# Altium schematic sheet Sheet2.SchDoc
size A3
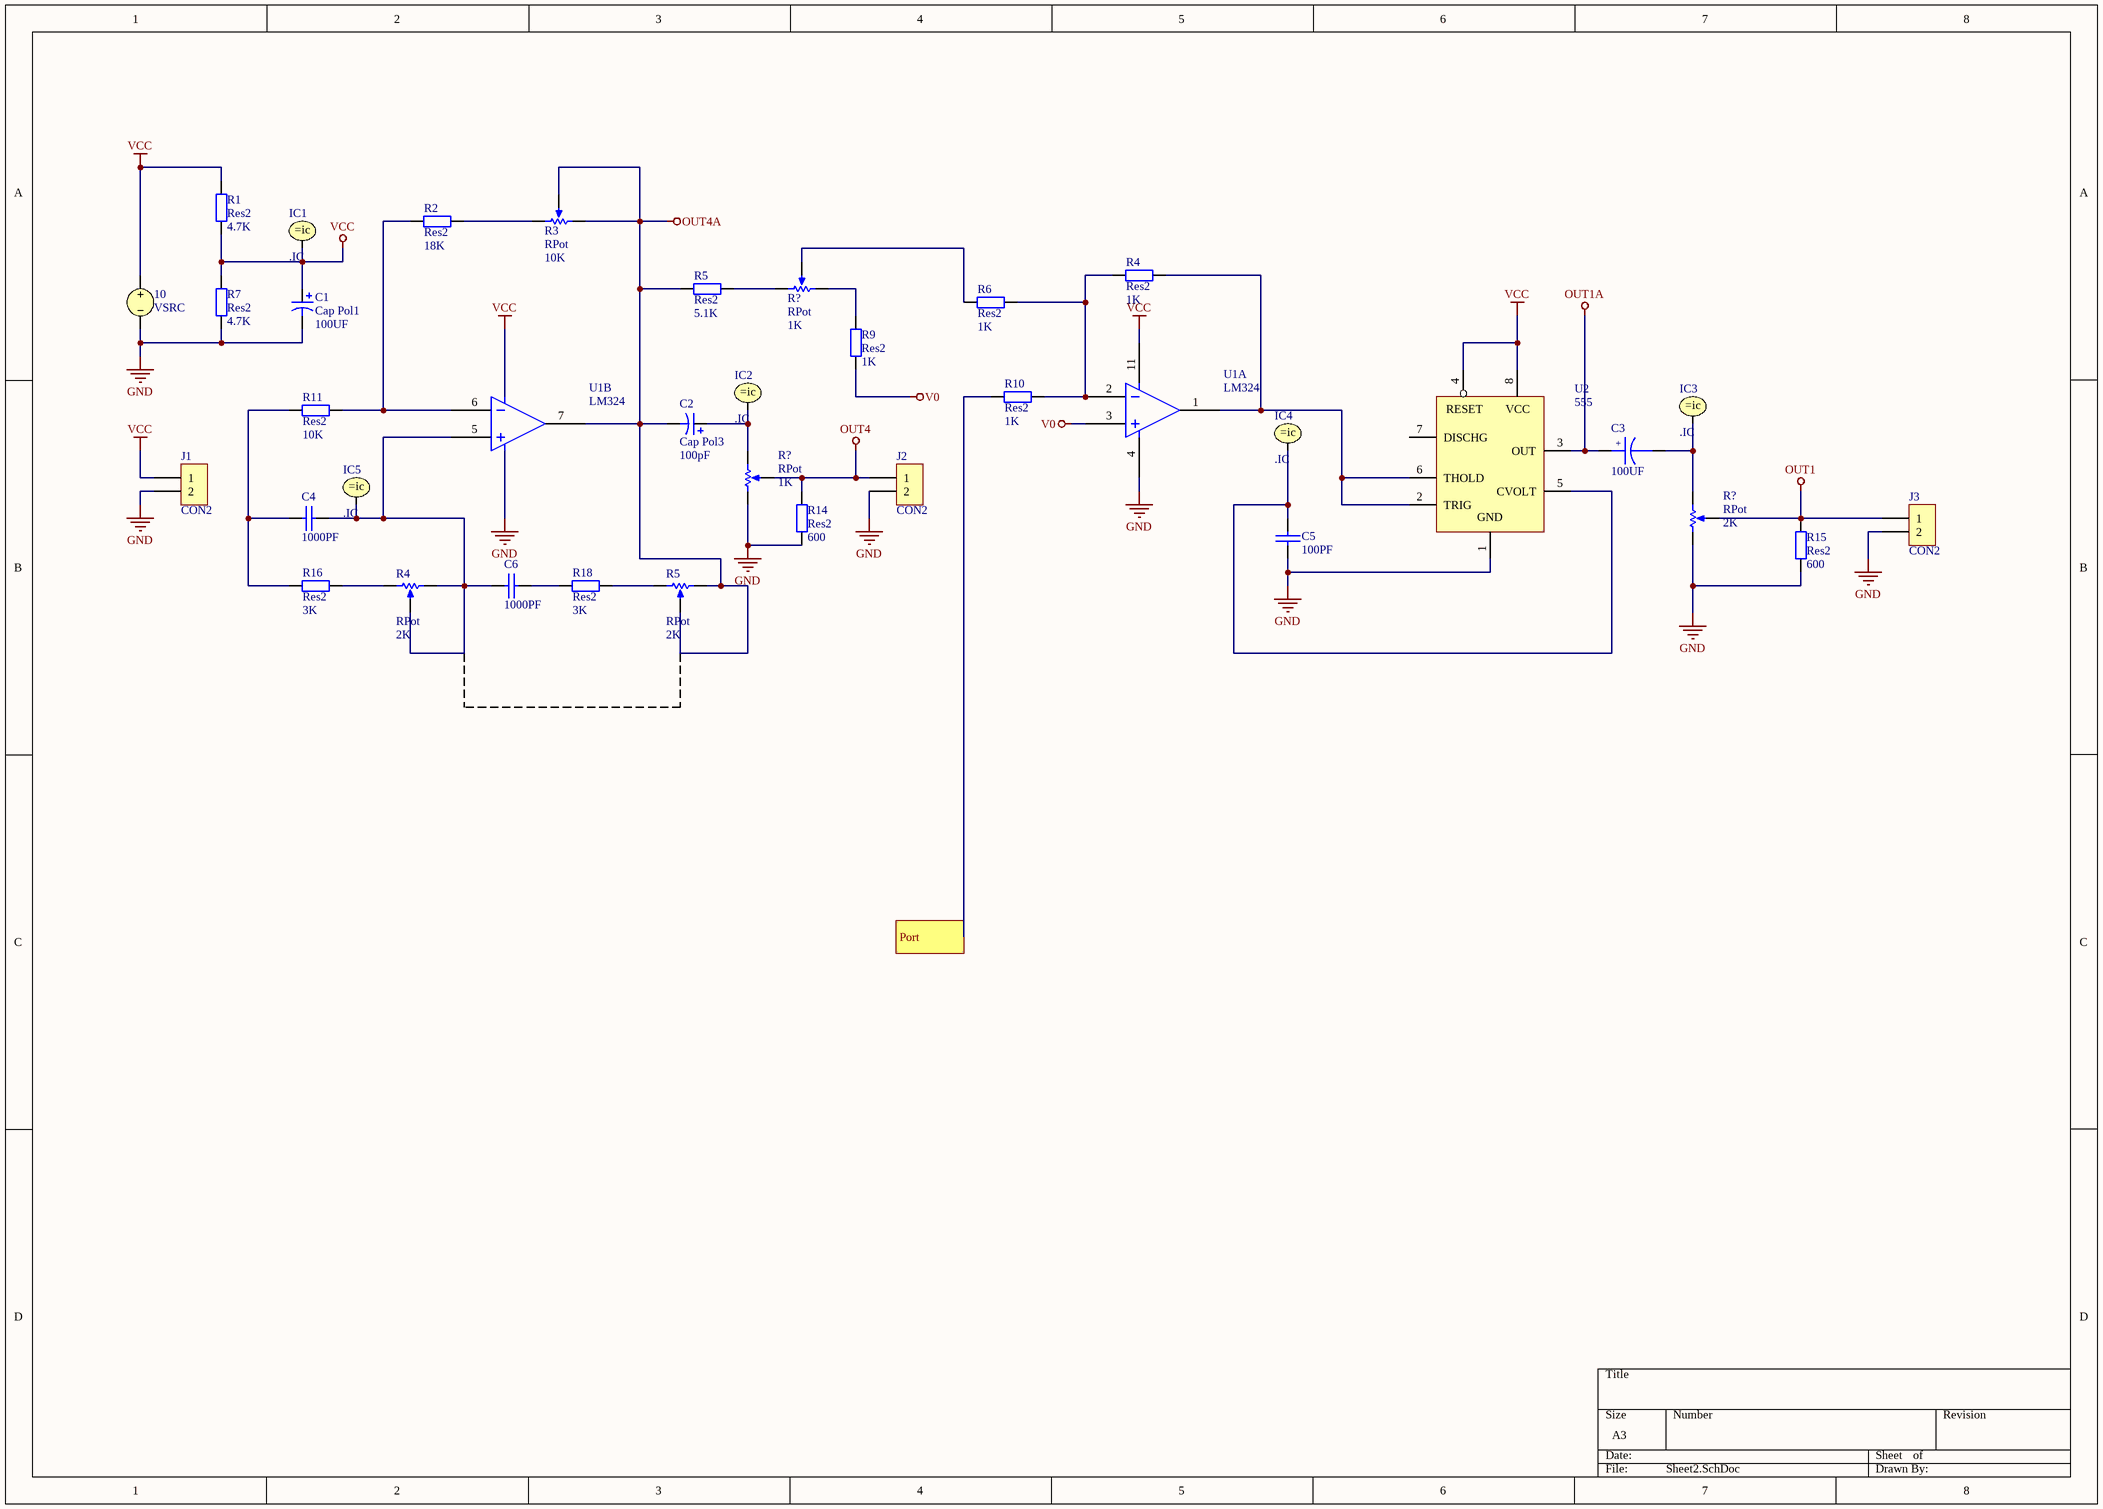
[diagram p0: Sheet2.SchDoc]

## Parts
(Parts that share a designator on the sheet are numbered #1, #2 ... from top to bottom, then left to right.)
10  VSRC
C1  Cap Pol1  value 100UF  [RB7.6-15]
C2  Cap Pol3  value 100pF  [C0805]
C3  100UF
C4  1000PF  [RAD0.1]
C5  100PF  [RAD0.1]
C6  1000PF  [RAD0.1]
IC1  .IC
IC2  .IC
IC3  .IC
IC4  .IC
IC5  .IC
J1  CON2
J2  CON2
J3  CON2
R1  Res2  value 4.7K  [AXIAL-0.4]
R2  Res2  value 18K  [AXIAL-0.4]
R3  RPot  value 10K  [VR5]
R4#1  Res2  value 1K  [AXIAL-0.4]
R4#2  RPot  value 2K  [VR5]
R5#1  Res2  value 5.1K  [AXIAL-0.4]
R5#2  RPot  value 2K  [VR5]
R6  Res2  value 1K  [AXIAL-0.4]
R7  Res2  value 4.7K  [AXIAL-0.4]
R9  Res2  value 1K  [AXIAL-0.4]
R10  Res2  value 1K  [AXIAL-0.4]
R11  Res2  value 10K  [AXIAL-0.4]
R14  Res2  value 600  [AXIAL-0.4]
R15  Res2  value 600  [AXIAL-0.4]
R16  Res2  value 3K  [AXIAL-0.4]
R18  Res2  value 3K  [AXIAL-0.4]
R?#1  RPot  value 1K  [VR5]
R?#2  RPot  value 1K  [VR5]
R?#3  RPot  value 2K  [VR5]
U1  LM324  [DIP-14]  (parts A,B of 4)
U2  555

## Ports
Port

## Nets
GND: 10.2 C1.2 C5.2 J1.2 J2.2 J3.2 R7.1 R14.1 R15.1 R?#2.1(TOP) R?#3.1(TOP) U1.4 U2.1(GND)
OUT1: J3.1 R15.2 R?#3.3(TAP)
OUT1A: C3.1 U2.3(OUT)
OUT4: J2.1 R14.2 R?#2.3(TAP)
OUT4A: C2.2 R3.1(TOP) R3.3(TAP) R5#1.1 R5#2.2(BOT) R5#2.3(TAP) U1.7
V0: R9.1 U1.3
VCC: 10.1 C1.1 IC1.1 J1.1 R1.1 R1.2 R7.2 U1.11 U2.4(RESET) U2.8(VCC)
Port: R10.2 ; port Port
NetC2_1: C2.1 IC2.1 R?#2.2(BOT)
NetC3_2: C3.2 IC3.1 R?#3.2(BOT)
NetC4_1: C4.1 R11.1 R16.1
NetC4_2: C4.2 C6.1 IC5.1 R4#2.2(BOT) R4#2.3(TAP) U1.5
NetC5_1: C5.1 IC4.1 U2.5(CVOLT)
NetC6_2: C6.2 R18.1
NetR2_1: R2.1 R11.2 U1.6
NetR2_2: R2.2 R3.2(BOT)
NetR4#1_1: R4#1.1 U1.1 U2.2(TRIG) U2.6(THOLD)
NetR4#1_2: R4#1.2 R6.1 R10.1 U1.2
NetR4#2_1: R4#2.1(TOP) R16.2
NetR5#1_2: R5#1.2 R?#1.2(BOT)
NetR5#2_1: R5#2.1(TOP) R18.2
NetR6_2: R6.2 R?#1.3(TAP)
NetR9_2: R9.2 R?#1.1(TOP)

Not connected (* = marked no-connect by the designer): U2 7(DISCHG)

## Notes on the sheet
- (in symbol 电解电容) +

## Library data of the parts
10 = VSRC: Voltage Source; Note: PCB Footprint - Not required; Value: +5; Published: 8-Jun-2000; LatestRevisionDate: 17-Jul-2002; LatestRevisionNote: Re-released for DXP Platform.; PackageReference: Not Applicable; Publisher: Altium Limited
C1 = Cap Pol1: Polarized Capacitor (Radial); Published: 8-Jun-2000; LatestRevisionDate: 17-Jul-2002; LatestRevisionNote: Re-released for DXP Platform.; PackageReference: RB7.6-15; Publisher: Altium Limited; PackageDescription: Polarized Capacitor (Radial); 2 Leads
C2 = Cap Pol3: Polarized Capacitor (Surface Mount); Published: 8-Jun-2000; LatestRevisionDate: 29-May-2009; LatestRevisionNote: IPC-7351 Footprint Added.; PackageReference: C0805; Publisher: Altium Limited; PackageDescription: Chip Capacitor
C3 = 电解电容: Capacitor
C4-C6 = 普通电容: Capacitor
IC1-IC5 = .IC: Initial Condition; Published: 8-Jun-2000; LatestRevisionDate: 17-Jul-2002; LatestRevisionNote: Re-released for DXP Platform.; PackageReference: Not Applicable; Publisher: Altium Limited
J1-J3 = CON2: Connector
R1 R2 R4#1 R5#1 R6 R7 R9-R11 R14-R16 R18 = Res2: Resistor; Published: 8-Jun-2000; LatestRevisionDate: 17-Jul-2002; LatestRevisionNote: Re-released for DXP Platform.; PackageReference: AXIAL-0.4; Publisher: Altium Limited; PackageDescription: Axial Device, Thru-Hole; 2 Leads; 0.4 in Pin Spacing
R3 R4#2 R5#2 R?#1-R?#3 = RPot: Potentiometer; Sim Note: Enter the Resistance value and the set point into parameter fields.; Set Position: 0.5; Published: 8-Jun-2000; LatestRevisionDate: 17-Jul-2002; LatestRevisionNote: Re-released for DXP Platform.; PackageReference: VR5; Publisher: Altium Limited; PackageDescription: Variable Resistor, Thru-Hole; 3 Leads
U2 = 555: Timer